# EAGLE design OSO-MISC-20-018 Memory Gadget (EAGLE 9.6.2)
CHECKED: KTOWN; COMPANY: ADAFRUIT INDUSTRIES; DRAWN: KTOWN; REV: A
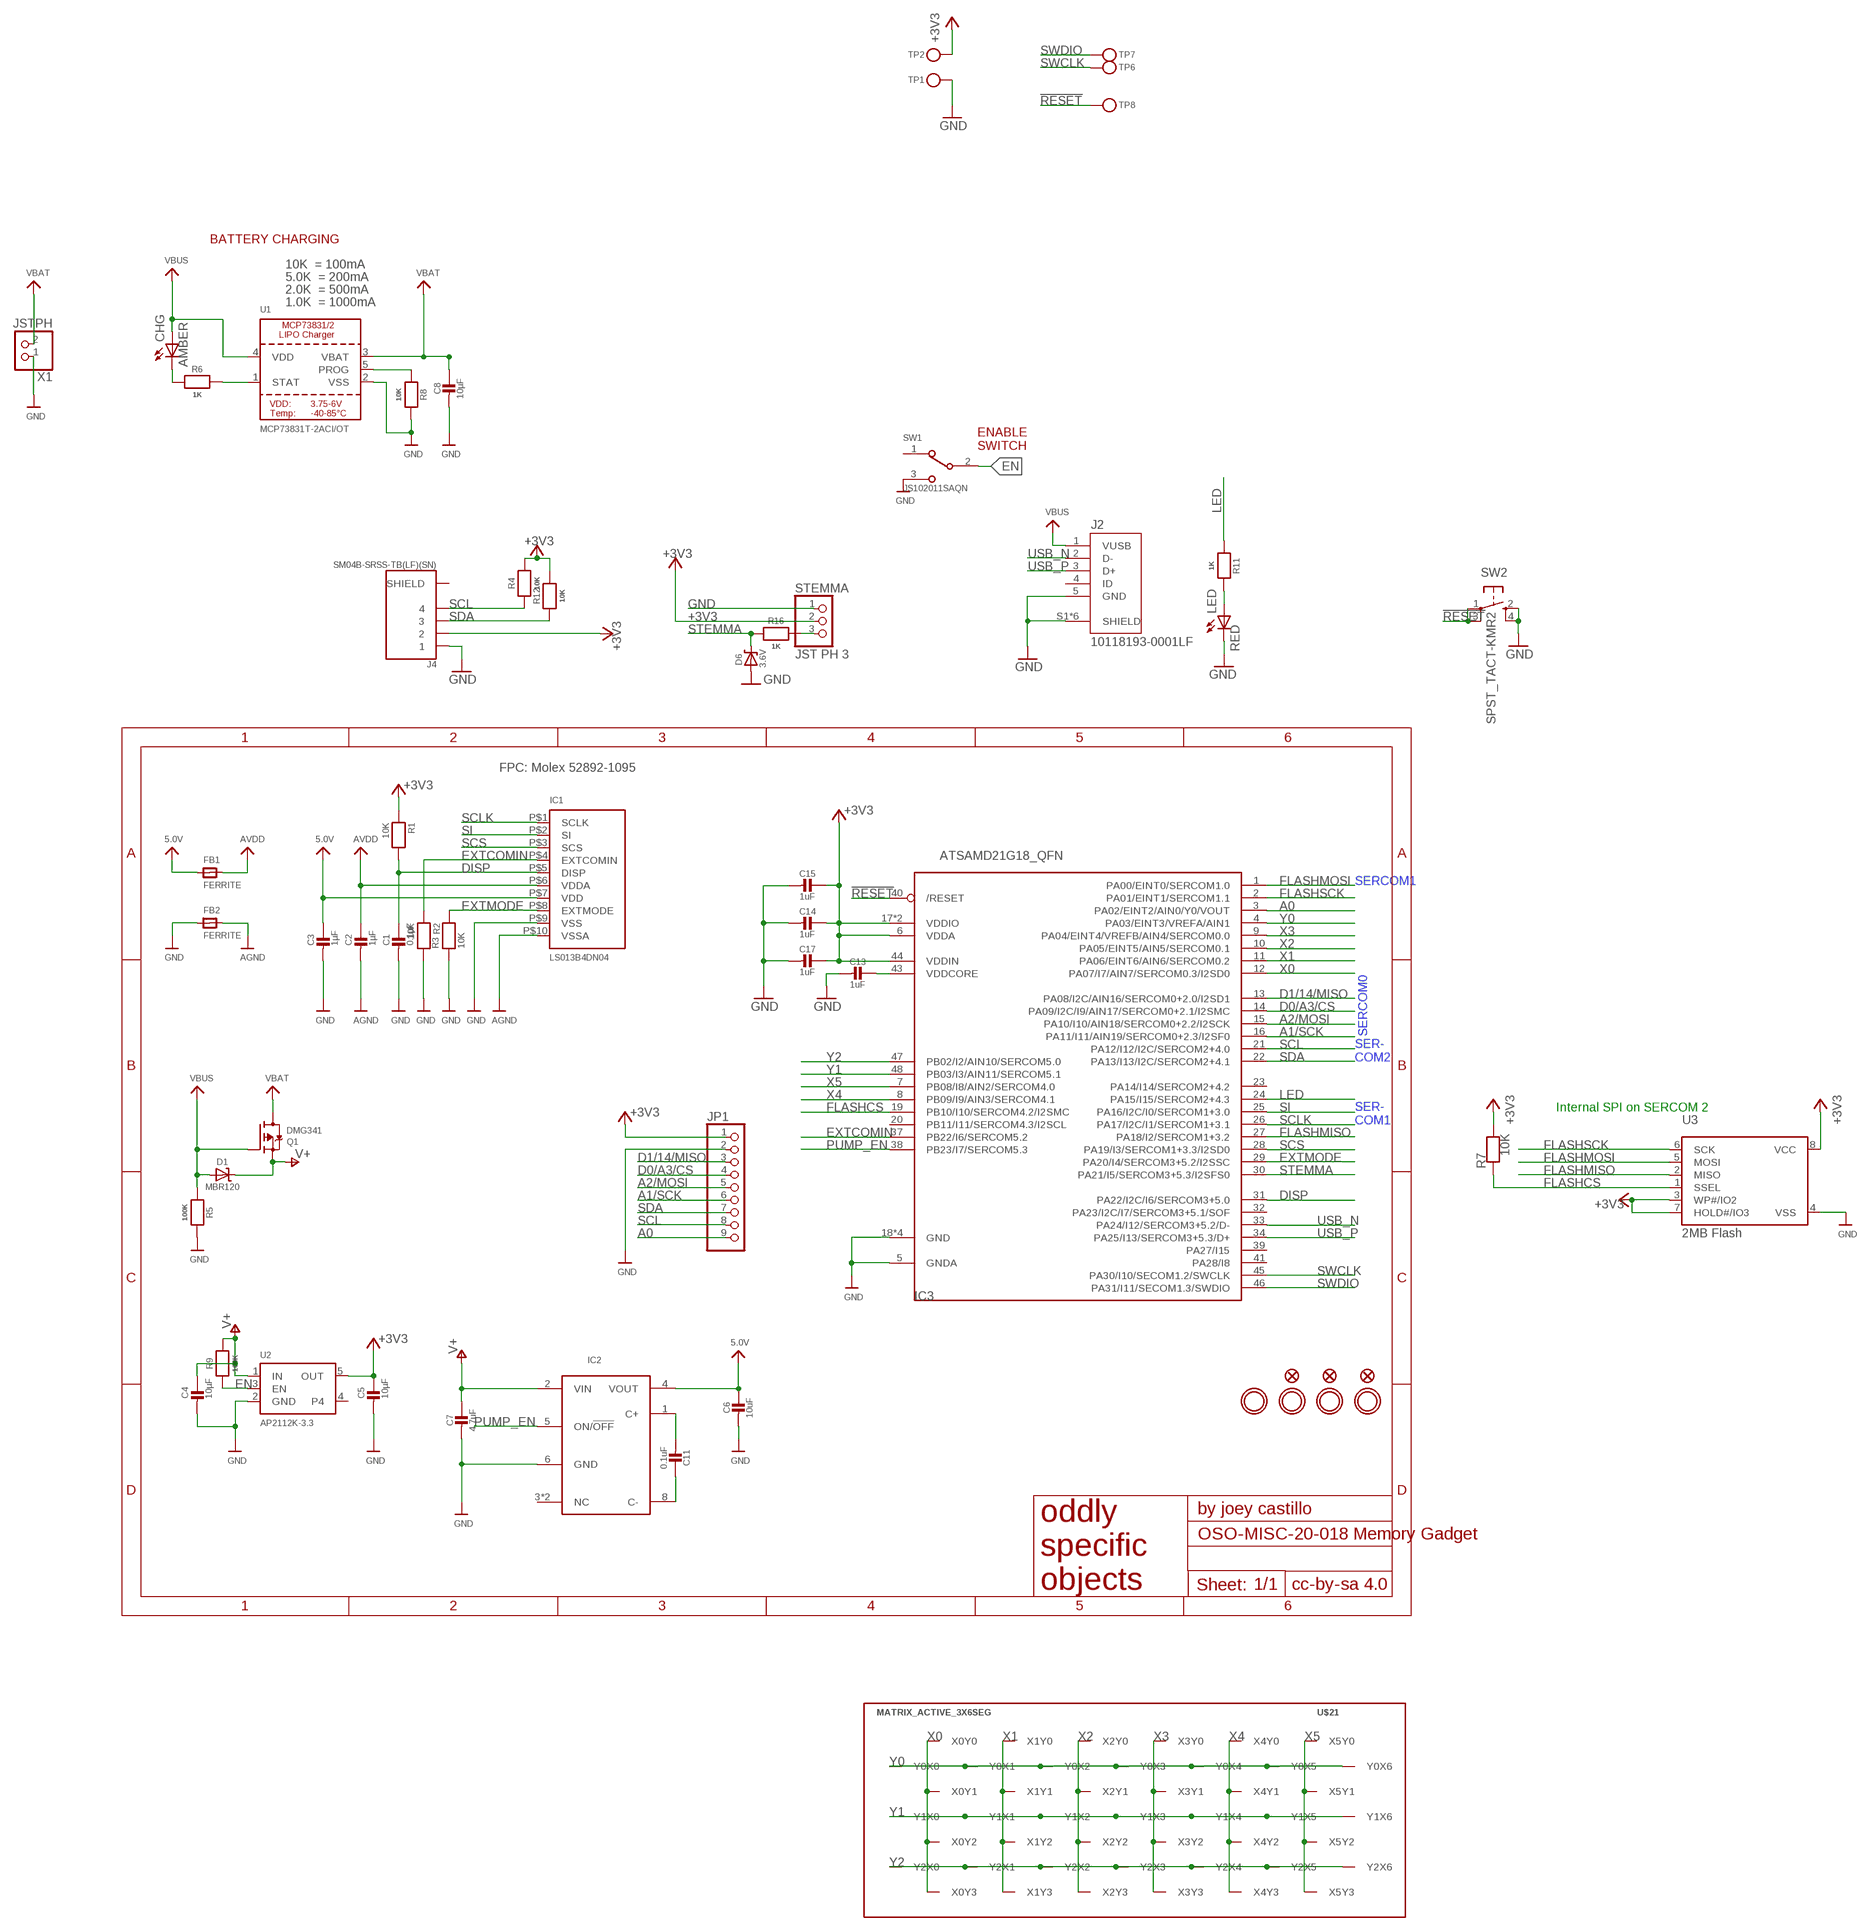
[diagram p0: schematic, sheet 1]

## Parts
C1  0.1µF  CAP_CERAMIC0603_NO  [0603-NO]
C2  1µF  CAP_CERAMIC0805_10MGAP  [0805_10MGAP]
C3  1µF  CAP_CERAMIC0805-NOOUTLINE  [0805-NO]
C4  10µF  CAP_CERAMIC0805-NOOUTLINE  [0805-NO]
C5  10µF  CAP_CERAMIC0805-NOOUTLINE  [0805-NO]
C6  10uF  CAP_CERAMIC0805-NOOUTLINE  [0805-NO]
C7  4.7uF  CAP_CERAMIC0805-NOOUTLINE  [0805-NO]
C8  10µF  CAP_CERAMIC0805-NOOUTLINE  [0805-NO]
C11  0.1uF  CAP_CERAMIC0805-NOOUTLINE  [0805-NO]
C13  1uF  CAP_CERAMIC0603_NO  [0603-NO]
C14  1uF  CAP_CERAMIC0603_NO  [0603-NO]
C15  1uF  CAP_CERAMIC0603_NO  [0603-NO]
C17  1uF  CAP_CERAMIC0603_NO  [0603-NO]
CHG  AMBER  LEDCHIP-LED0805  [CHIP-LED0805]
D1  MBR120  DIODE-SCHOTTKYSOD-123  [SOD-123]
D6  3.6V  DIODE-ZENERSOD123  [SOD-123]
FB1  FERRITE  FERRITE_0805  [_0805]
FB2  FERRITE  FERRITE_0805  [_0805]
FID1  FIDUCIAL_1MM  [FIDUCIAL_1MM]
FID2  FIDUCIAL_1MM  [FIDUCIAL_1MM]
FID3  FIDUCIAL_1MM  [FIDUCIAL_1MM]
IC1  LS013B4DN04  DISP_EINK_SHARPMEMORYLCD_10PIN_27IN  [SHARP_2.7IN]
IC2  S-882150APH  [SNT-8A]
IC3  ATSAMD21G18_QFN  ATSAMD21G_QFN  [TQFN48_7MM]
J2  10118193-0001LF  [FCI_10118193-0001LF]
J4  SM04B-SRSS-TB(LF)(SN)  [JST_SM04B-SRSS-TB(LF)(SN)]
JP1  HEADER-1X9_JSTSH  [JST_SH9]
LED  RED  LEDCHIP-LED0805  [CHIP-LED0805]
Q1  DMG341  MOSFET-P  [SOT23-R]
R1  10K  RESISTOR_0603_NOOUT  [0603-NO]
R2  10K  RESISTOR_0603_NOOUT  [0603-NO]
R3  10K  RESISTOR_0603_NOOUT  [0603-NO]
R4  10K  RESISTOR_0603_NOOUT  [0603-NO]
R5  100K  RESISTOR0805_NOOUTLINE  [0805-NO]
R6  1K  RESISTOR0805_NOOUTLINE  [0805-NO]
R7  10K  RESISTOR_0603_NOOUT  [0603-NO]
R8  10K  RESISTOR0805_NOOUTLINE  [0805-NO]
R9  100K  RESISTOR0805_NOOUTLINE  [0805-NO]
R11  1K  RESISTOR0805_NOOUTLINE  [0805-NO]
R12  10K  RESISTOR_0603_NOOUT  [0603-NO]
R16  1K  RESISTOR_0805MP  [_0805MP]
STEMMA  JST PH 3  CON_JST_PH_3PIN  [JSTPH3]
SW1  JS102011SAQN  [SW_JS102011SAQN]
SW2  SPST_TACT-KMR2  [KMR2]
TP1  TESTPOINTROUND2MMNO  [TESTPOINT_ROUND_2MM_NO]
TP2  TESTPOINTROUND2MMNO  [TESTPOINT_ROUND_2MM_NO]
TP6  TESTPOINTROUND2MMNO  [TESTPOINT_ROUND_2MM_NO]
TP7  TESTPOINTROUND2MMNO  [TESTPOINT_ROUND_2MM_NO]
TP8  TESTPOINTROUND2MMNO  [TESTPOINT_ROUND_2MM_NO]
U1  MCP73831T-2ACI/OT  MCP73831/2  [SOT23-5]
U2  AP2112K-3.3  VREG_SOT23-5  [SOT23-5]
U3  2MB Flash  SPIFLASH_SOIC8  [SOIC8_150MIL]
U$9  MOUNTINGHOLE2.5  [MOUNTINGHOLE_2.5_PLATED]
U$10  MOUNTINGHOLE2.5  [MOUNTINGHOLE_2.5_PLATED]
U$21  MATRIX_ACTIVE_3X6SEG  [MATRIX_ACTIVE_3X6SEG_6MM]
U$27  MOUNTINGHOLE2.5  [MOUNTINGHOLE_2.5_PLATED]
U$28  MOUNTINGHOLE2.5  [MOUNTINGHOLE_2.5_PLATED]
X1  JSTPH  CON_JST_PH_2PIN  [JSTPH2]

## Nets
5.0V: C3.1 C6.1 FB1.1 IC1.P$7(VDD) IC2.4(VOUT)
!RESET: IC3.40(/RESET) SW2.1(P) SW2.3(P1) TP8.P$1
+3V3: C5.1 C14.1 C15.1 C17.1 IC3.6(VDDA) IC3.17(VDDIO) IC3.36(VDDIO) IC3.44(VDDIN) J4.2 JP1.1 R1.1 R4.2 R7.2 R12.2 STEMMA.2 TP2.P$1 U2.5(OUT) U3.3(WP#/IO2) U3.7(HOLD#/IO3) U3.8(VCC)
A0: IC3.3(PA02/EINT2/AIN0/Y0/VOUT) JP1.9
A1/SCK: IC3.16(PA11/I11/AIN19/SERCOM0+2.3/I2SF0) JP1.6
A2/MOSI: IC3.15(PA10/I10/AIN18/SERCOM0+2.2/I2SCK) JP1.5
AGND: C2.2 FB2.2 IC1.P$10(VSSA)
AVDD: C2.1 FB1.2 IC1.P$6(VDDA)
D0/A3/CS: IC3.14(PA09/I2C/I9/AIN17/SERCOM0+2.1/I2SMC) JP1.4
D1/14/MISO: IC3.13(PA08/I2C/AIN16/SERCOM0+2.0/I2SD1) JP1.3
DISP: C1.1 IC1.P$5(DISP) IC3.31(PA22/I2C/I6/SERCOM3+5.0) R1.2
EN: R9.1 SW1.2 U2.3(EN)
EXTCOMIN: IC1.P$4(EXTCOMIN) IC3.37(PB22/I6/SERCOM5.2) R2.1
EXTMODE: IC1.P$8(EXTMODE) IC3.29(PA20/I4/SERCOM3+5.2/I2SSC) R3.2
FLASHCS: IC3.19(PB10/I10/SERCOM4.2/I2SMC) R7.1 U3.1(SSEL)
FLASHMISO: IC3.27(PA18/I2/SERCOM1+3.2) U3.2(MISO)
FLASHMOSI: IC3.1(PA00/EINT0/SERCOM1.0) U3.5(MOSI)
FLASHSCK: IC3.2(PA01/EINT1/SERCOM1.1) U3.6(SCK)
GND: C1.2 C3.2 C4.2 C5.2 C6.2 C7.2 C8.2 C13.2 C14.2 C15.2 C17.2 D6.A FB2.1 IC1.P$9(VSS) IC2.6(GND) IC3.5(GNDA) IC3.18(GND) IC3.35(GND) IC3.42(GND) IC3.THERMAL(GND) J2.5(GND) J2.S1(SHIELD) J2.S2(SHIELD) J2.S3(SHIELD) J2.S4(SHIELD) J2.S5(SHIELD) J2.S6(SHIELD) J4.1 JP1.2 LED.C R2.2 R3.1 R5.2 R8.2 STEMMA.1 SW1.3 SW2.2(S) SW2.4(S1) TP1.P$1 U1.2(VSS) U2.2(GND) U3.4(VSS) X1.1
LED: IC3.24(PA15/I15/SERCOM2+4.3) R11.1
N$1: LED.A R11.2
N$2: CHG.C R6.1
N$3: C11.2 IC2.1(C+)
N$4: C11.1 IC2.8(C-)
PROG: R8.1 U1.5(PROG)
PUMP_EN: IC2.5(ON/!OFF) IC3.38(PB23/I7/SERCOM5.3)
SCL: IC3.21(PA12/I12/I2C/SERCOM2+4.0) J4.4 JP1.8 R4.1
SCLK: IC1.P$1(SCLK) IC3.26(PA17/I2C/I1/SERCOM1+3.1)
SCS: IC1.P$3(SCS) IC3.28(PA19/I3/SERCOM1+3.3/I2SD0)
SDA: IC3.22(PA13/I13/I2C/SERCOM2+4.1) J4.3 JP1.7 R12.1
SI: IC1.P$2(SI) IC3.25(PA16/I2C/I0/SERCOM1+3.0)
STAT: R6.2 U1.1(STAT)
STEMMA: D6.C IC3.30(PA21/I5/SERCOM3+5.3/I2SFS0) R16.2
STEMMA_: R16.1 STEMMA.3
SWCLK: IC3.45(PA30/I10/SECOM1.2/SWCLK) TP6.P$1
SWDIO: IC3.46(PA31/I11/SECOM1.3/SWDIO) TP7.P$1
USB_N: IC3.33(PA24/I12/SERCOM3+5.2/D-) J2.2(D-)
USB_P: IC3.34(PA25/I13/SERCOM3+5.3/D+) J2.3(D+)
V+ [power]: C4.1 C7.1 D1.C IC2.2(VIN) Q1.2(S) R9.2 U2.1(IN)
VBAT [power]: C8.1 Q1.3(D) U1.3(VBAT) X1.2
VBUS [power]: CHG.A D1.A J2.1(VUSB) Q1.1(G) R5.1 U1.4(VDD)
VDDCORE: C13.1 IC3.43(VDDCORE)
X0: IC3.12(PA07/I7/AIN7/SERCOM0.3/I2SD0) U$21.X0Y0 U$21.X0Y1 U$21.X0Y2 U$21.X0Y3
X1: IC3.11(PA06/EINT6/AIN6/SERCOM0.2) U$21.X1Y0 U$21.X1Y1 U$21.X1Y2 U$21.X1Y3
X2: IC3.10(PA05/EINT5/AIN5/SERCOM0.1) U$21.X2Y0 U$21.X2Y1 U$21.X2Y2 U$21.X2Y3
X3: IC3.9(PA04/EINT4/VREFB/AIN4/SERCOM0.0) U$21.X3Y0 U$21.X3Y1 U$21.X3Y2 U$21.X3Y3
X4: IC3.8(PB09/I9/AIN3/SERCOM4.1) U$21.X4Y0 U$21.X4Y1 U$21.X4Y2 U$21.X4Y3
X5: IC3.7(PB08/I8/AIN2/SERCOM4.0) U$21.X5Y0 U$21.X5Y1 U$21.X5Y2 U$21.X5Y3
Y0: IC3.4(PA03/EINT3/VREFA/AIN1) U$21.Y0X0 U$21.Y0X1 U$21.Y0X2 U$21.Y0X3 U$21.Y0X4 U$21.Y0X5 U$21.Y0X6
Y1: IC3.48(PB03/I3/AIN11/SERCOM5.1) U$21.Y1X0 U$21.Y1X1 U$21.Y1X2 U$21.Y1X3 U$21.Y1X4 U$21.Y1X5 U$21.Y1X6
Y2: IC3.47(PB02/I2/AIN10/SERCOM5.0) U$21.Y2X0 U$21.Y2X1 U$21.Y2X2 U$21.Y2X3 U$21.Y2X4 U$21.Y2X5 U$21.Y2X6
Unconnected: IC2.3(NC) IC2.7(NC) IC3.20(PB11/I11/SERCOM4.3/I2SCL) IC3.23(PA14/I14/SERCOM2+4.2) IC3.32(PA23/I2C/I7/SERCOM3+5.1/SOF) IC3.39(PA27/I15) IC3.41(PA28/I8) J2.4(ID) J4.S1(SHIELD) J4.S2(SHIELD) SW1.1 U2.4

## Notes on the sheet
- BATTERY CHARGING
- 10K  = 100mA
- 5.0K  = 200mA
- 2.0K  = 500mA
- 1.0K  = 1000mA
- ENABLE
  SWITCH
- FPC: Molex 52892-1095
- SERCOM1
- SERCOM0
- SER-
  COM2
- Internal SPI on SERCOM 2
- SER-
  COM1

## Library data of the parts
C1-C3 C6-C8 C11 C13-C15 C17 = microbuilder:CAP_CERAMIC: Ceramic Capacitors For new designs, use the packages preceded by an '_' character since they are more reliable: The following footprints should be used on most boards: _0402 - Standard footprint for regular board layouts _0603 - Standard footprint for regular board layouts _0805 - Standard footprint for regular board layouts _1206 - Standard footprint for regular board layouts For extremely tight-pitch boards where space is at a premium, the following 'micro-pitch' footprints can be used (smaller pads, no silkscreen outline, etc.): _0402MP - Micro-pitch footprint for very dense/compact boards _0603MP - Micro-pitch footprint for very dense/compact boards _0805MP - Micro-pitch footprint for very dense/compact boards _1206MP - Micro-pitch footprint for very dense/compact boards
C4 C5 = microbuilder:CAP_CERAMIC: Ceramic Capacitors For new designs, use the packages preceded by an '_' character since they are more reliable: The following footprints should be used on most boards: _0402 - Standard footprint for regular board layouts _0603 - Standard footprint for regular board layouts _0805 - Standard footprint for regular board layouts _1206 - Standard footprint for regular board layouts For extremely tight-pitch boards where space is at a premium, the following 'micro-pitch' footprints can be used (smaller pads, no silkscreen outline, etc.): _0402MP - Micro-pitch footprint for very dense/compact boards _0603MP - Micro-pitch footprint for very dense/compact boards _0805MP - Micro-pitch footprint for very dense/compact boards _1206MP - Micro-pitch footprint for very dense/compact boards; REV: A
CHG LED = adafruit:LED: LED OSRAM: - CHIPLED LG R971, LG N971, LY N971, LG Q971, LY Q971, LO R971, LY R971 LH N974, LH R974 LS Q976, LO Q976, LY Q976 LO Q996 - Hyper CHIPLED LW Q18S LB Q993, LB Q99A, LB R99A - SideLED LS A670, LO A670, LY A670, LG A670, LP A670 LB A673, LV A673, LT A673, LW A673 LH A674 LY A675 LS A676, LA A676, LO A676, LY A676, LW A676 LS A679, LY A679, LG A679 - Hyper Micro SIDELED® LS Y876, LA Y876, LO Y876, LY Y876 LT Y87S - SmartLED LW L88C, LW L88S LB L89C, LB L89S, LG L890 LS L89K, LO L89K, LY L89K LS L896, LA L896, LO L896, LY L896 - TOPLED LS T670, LO T670, LY T670, LG T670, LP T670 LSG T670, LSP T670, LSY T670, LOP T670, LYG T670 LG T671, LOG T671, LSG T671 LB T673, LV T673, LT T673, LW T673 LH T674 LS T676, LA T676, LO T676, LY T676, LB T676, LH T676, LSB T676, LW T676 LB T67C, LV T67C, LT T67C, LS T67K, LO T67K, LY T67K, LW E67C LS E67B, LA E67B, LO E67B, LY E67B, LB E67C, LV E67C, LT E67C LW T67C LS T679, LY T679, LG T679 LS T770, LO T770, LY T770, LG T770, LP T770 LB T773, LV T773, LT T773, LW T773 LH T774 LS E675, LA E675, LY E675, LS T675 LS T776, LA T776, LO T776, LY T776, LB T776 LHGB T686 LT T68C, LB T68C - Hyper Mini TOPLED® LB M676 - Mini TOPLED Santana® LG M470 LS M47K, LO M47K, LY M47K Source: http://www.osram.convergy.de/
D1 = microbuilder:DIODE-SCHOTTKY
D6 = microbuilder:DIODE-ZENER: Zener Diode SMA: 30V 1W Zener Diode, 1.2Vf - Digikey: SMAZ30-FDICT-ND
FB1 FB2 = microbuilder:FERRITE: Ferrite Bead 0603 MMZ1608B121C - 120 Ohm @ 100MHz, 600mA, 0.15 Ohm DC Resistance - Digikey: 445-2164-1-ND BK1608HW121-T - 120 Ohm, 600mA Ferrite Chip - Digikey: 587-1876-2-ND 0805 HZ0805B272R-10 - 2.7K Ohm @ 100MHz, 200mA, 0.8 Ohm DC Resistance - Digikey: 240-2504-1-ND (see also Murata BLM21BD272SN1L) MMZ2012Y152B - 1.5K Ohm @ 100MHz, 500mA, 0.4 Ohm DC Resistance - Digikey: 445-1560-1-ND - Mainly for high frequency (80-400MHz) MMZ2012R102A - 1K Ohm @ 100MHz, 500mA, 0.3 Ohm DC Resistance - Digikey: 445-1555-2-ND - More general purpose (10-200MHz)
FID1 FID2 = microbuilder:FIDUCIAL: Fiducial Alignment Points Various fiducial points for machine vision alignment.; BOM: EXCLUDE
FID3 = microbuilder:FIDUCIAL: Fiducial Alignment Points Various fiducial points for machine vision alignment.; BOM: EXCLUDE; REV: A
IC1 = adafruit_display:DISP_EINK_SHARPMEMORYLCD_10PIN: Sharp Mono Memory LCD LS013B4DN04 - 1.35" 96x96 Pixels LS027B7DH01 - 2.7" 400x240 Pixels FPC Connector: Molex 52892-1095 (WM9203CT-ND)
IC2 = My Stuff:S-882150APH
IC3 = microbuilder:ATSAMD21G
J2 = 10118193-0001LF:10118193-0001LF: Micro USB B Type Receptacle; DESCRIPTION: Single Port 5 Contact Shielded SMT MICRO USB B-Type Receptacle; DIGI-KEY_PART_NUMBER: 609-4616-1-ND; DIGI-KEY_PURCHASE_URL: https://www.digikey.com/product-detail/en/amphenol-icc-fci/10118193-0001LF/609-4616-1-ND/2785380?utm_source=snapeda&utm_medium=aggregator&utm_campaign=symbol; MF: Amphenol ICC; MP: 10118193-0001LF; PACKAGE: None
J4 = SM04B-SRSS-TB_LF__SN_:SM04B-SRSS-TB(LF)(SN): SH Series 1.0 mm Pitch 2 Position Single Row Side Entry Shrouded Header; DESCRIPTION: SH Series 1.0 mm Pitch 2 Position Single Row Side Entry Shrouded Header; DIGI-KEY_PART_NUMBER: 455-1804-1-ND; DIGI-KEY_PURCHASE_URL: https://www.digikey.com/product-detail/en/jst-sales-america-inc/SM04B-SRSS-TB_LF__SN_/455-1804-1-ND/926875?utm_source=snapeda&utm_medium=aggregator&utm_campaign=symbol; MF: JST Sales; MP: SM04B-SRSS-TB_LF__SN_; PACKAGE: None
JP1 = microbuilder:HEADER-1X9: PIN HEADER
Q1 = microbuilder:MOSFET-P: P-Channel Mosfet LEGEND VDS: Voltage Drain-Source ID: Drain Current RDS(ON): Drain-Source On-State Resistance VGS(TH): Gate-Source Threshold Voltage CISS: Drain-Source Input Capacitance SOT-23 Name VDS ID RDS(ON) VGS(TH) CISS Order Number IRLML5103 30V 760mA 600 mOhm -- 75pF @ 25V Digikey: IRLML5103PBFCT-ND IRLML6401 12V 4.3A 50 mOhm 950mV @ 250µA 830pF @ 10V Digikey: IRLML6401PBFTR-ND NTR0202PL 20V 400mA 800 mOhm 2.3V @ 250uA 70pF @ 5V Digikey: NTR0202PLT1GOSTR-ND NTR4101PT1G 20V 1.8A 85 mOhm 1.2V @ 250uA 675pF @ 10V Digikey: NTR4101PT1GOSCT-ND DMP2004K 20V 600mA 900 mOhm 1V @ 250uA 175pF @ 16V Digikey: DMP2004KDICT-ND PMV65XP 20V 3.9A 76 mOhm 950mV @ 1mA 725pF @ 20V Digikey: 568-2358-2-ND TO-252 Name VDS ID RDS(ON) VGS(TH) CISS Order Number AOD417 30V 25A 34 mOhm 3V @ 250µA 920pF @ 15V Digikey: 785-1106-2-ND PowerPak Name VDS ID RDS(ON) VGS(TH) CISS Order Number AON7401 30V 12A 14 mOhm 3V @ 250µA 2600pF @ 15V Digikey: 785-1302-1-ND
R1 R2 R4-R9 R11 R12 R16 = microbuilder:RESISTOR: Resistors For new designs, use the packages preceded by an '_' character since they are more reliable: The following footprints should be used on most boards: _0402 - Standard footprint for regular board layouts _0603 - Standard footprint for regular board layouts _0805 - Standard footprint for regular board layouts _1206 - Standard footprint for regular board layouts For extremely tight-pitch boards where space is at a premium, the following 'micro-pitch' footprints can be used (smaller pads, no silkscreen outline, etc.): _0402MP - Micro-pitch footprint for very dense/compact boards _0603MP - Micro-pitch footprint for very dense/compact boards _0805MP - Micro-pitch footprint for very dense/compact boards _1206MP - Micro-pitch footprint for very dense/compact boards
R3 = microbuilder:RESISTOR: Resistors For new designs, use the packages preceded by an '_' character since they are more reliable: The following footprints should be used on most boards: _0402 - Standard footprint for regular board layouts _0603 - Standard footprint for regular board layouts _0805 - Standard footprint for regular board layouts _1206 - Standard footprint for regular board layouts For extremely tight-pitch boards where space is at a premium, the following 'micro-pitch' footprints can be used (smaller pads, no silkscreen outline, etc.): _0402MP - Micro-pitch footprint for very dense/compact boards _0603MP - Micro-pitch footprint for very dense/compact boards _0805MP - Micro-pitch footprint for very dense/compact boards _1206MP - Micro-pitch footprint for very dense/compact boards; REV: A
STEMMA = microbuilder:CON_JST_PH_3PIN
SW1 = JS102011SAQN:JS102011SAQN: JS10 Series SPDT On-On 6 V 0.3 A Gull Wing SMT Slide Switch http://www.snapeda.com/parts/JS102011SAQN/C%26K%20Components/view-part/; DESCRIPTION: Slide Switch SPDT Surface Mount, Right Angle; DIGI-KEY_PART_NUMBER: 401-1999-1-ND; DIGI-KEY_PURCHASE_URL: https://www.digikey.com/product-detail/en/c-k/JS102011SAQN/401-1999-1-ND/1640114?utm_source=snapeda&utm_medium=aggregator&utm_campaign=symbol; MF: C&K; MP: JS102011SAQN; PACKAGE: None
SW2 = adafruit:SPST_TACT: SMT 6mm switch, EVQQ2 series http://www.ladyada.net/library/eagle
TP1 TP2 TP6-TP8 = microbuilder:TESTPOINT: Test Point Various test points for characterisation and PCB testing TESTPOINT_SMT - Compact Surface Mount Test Point [Digikey: 5016KTR-ND]
U1 = microbuilder:MCP73831/2: MCP73831/2 LIPO Charger VDD: 3.75 - 6V Temp -40 - 85°C Programmable Charge Rate: 15-500mA NOTE: STAT is a tri-state logic output on the MCP73831 and an open-drain output on the MCP73832. SOT23-5 with 4.2V output and tri-state logic on STAT = MCP73831T-2ACI/OT
U2 = adafruit_power:VREG_SOT23-5: SOT23-5 Fixed Voltage Regulators Part Current Out V Out V In V Dropout θJA (°C/W) TJ (°C) Digikey Part No. ADP121 150mA 3.3V 3.4-5.5V 0.09V @ 150mA -- -- ADP121-AUJZ33R7CT-ND ADP121 150mA 3.0V 3.1-5.5V 0.09V @ 150mA -- -- ADP121-AUJZ30R7CT-ND ADP122 300mA 3.3V 3.4-5.5V 0.085V @ 300mA -- -- ADP122AUJZ-3.3-R7CT-ND ADP1712 300mA 3.3V 3.5-5.5V 0.17V @ 300mA -- -- ADP1712AUJZ-3.3-R7TR-ND AP7311 (Low Cost) 150mA 3.3V 3.5-6V 0.15V @ 150mA -- -- AP7311-33WG-7DICT-ND LD39015M18R 150mA 1.8V 1.9V-5.5V 0.08V @ 100mA -- -- 497-6977-1-ND LP2985A-33DBVR 150mA 3.3V 3.3-16V 0.28V @ 150mA 206 150 296-18479-1-ND MCP1824T-3302E/OT 300mA 3.3V 3.5V-6V 0.2V @ 300mA -- -- MCP1824T-3302E/OTCT-ND MIC5205-2.5YM5 TR 150mA 2.5V 2.7-16V 0.165V @ 150mA -- -- 576-1257-2-ND MIC5205-3.0YM5 TR 150mA 3.0V 3.2V-16V 0.165V @ 150mA -- -- 576-1258-2-ND MIC5205-3.3YM5 TR 150mA 3.3V 3.5V-16V 0.165V @ 150mA -- -- 576-1259-2-ND TPS780330220 150mA 3.3V+2.2V 3.6-5.5V 250mV Max -- -- 296-23332-1-ND TDA3663/N1,135 100mA 3.3V 3.5-45V 0.18V @ 50mA -- -- 568-5343-1-ND Max operating temp can be calculated using θJA, TJ (max junction temperature), and power in watts. Set the "Maximum Ambient Temperature" until it reaches TJ ("Max Junction Temperature"), which is the absolute limit for safe use of the regulator: Heat Sink Temperature Calculator <http://www.daycounter.com/Calculators/Heat-Sink-Temperature-Calculator.phtml> For example, With 12V source into a 3.3V LP2985 and a 30mA load, we are dissipating (12V-3.3V) * 0.03A = 0.261W. With a θJA of 206 °C/W, a TJ of 150°C, and 261mW we can safely use the chip without a heat sink up to 75°C (=147.1°C Junction Temperature).
U3 = microbuilder:SPIFLASH_SOIC8: SOIC8 SPI Flash Be careful with the size since SOIC8 flash comes in several 'widths' SOIC8 150 mil M25P16 - 16Mbit (2Mbit x 8) Serial Flash (75MHz SPI Bus), Supply: 2.7-3.6V Digikey: SOIC8 - M25P16-VMN6P-ND SOIC8 208 mil W25Q16BVSSIG - 16Mbit (2Mbit x 8) Serial Flash (104MHz SPI Bus), Supply: 2.7-3.6V Digikey: SOIC8 - W25Q16BVSSIG-ND
U$9 U$10 U$27 U$28 = microbuilder:MOUNTINGHOLE: Mounting Hole For #2 screws (0.086"/2.18mm width, 0.094"/2.4mm hole) use 2.5mm; BOM: EXCLUDE; REV: A
U$21 = My Stuff:MATRIX_ACTIVE_3X6SEG
X1 = microbuilder:CON_JST_PH_2PIN: JST 2-Pin Right-Angle Connector PH-Series - 4UConnector: 17311 SH-Series - 4UConnector: 07278

## Net classes
1 power: width 0.305 mm, drill 0.305 mm
2 gnd: width 0.254 mm, drill 0.254 mm

## Board
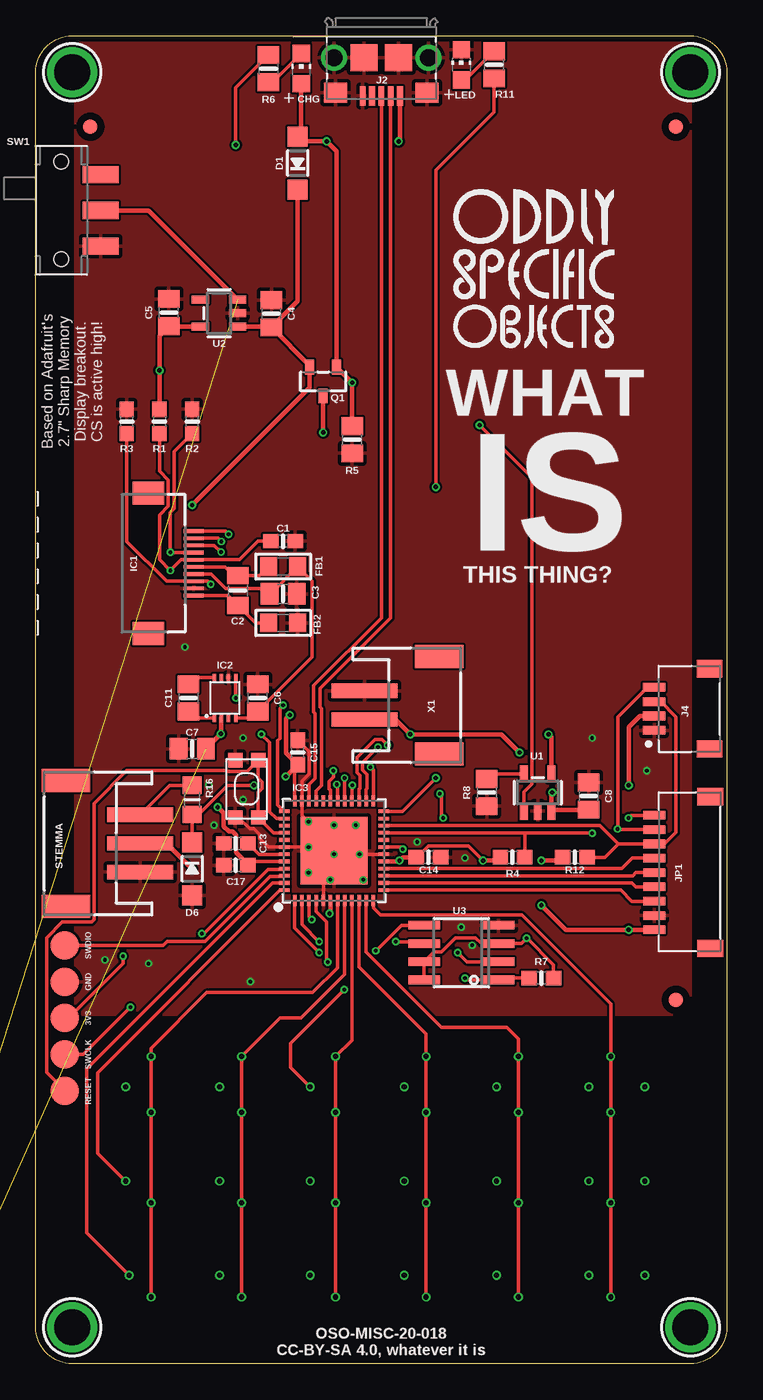
[diagram p1: board, top side]
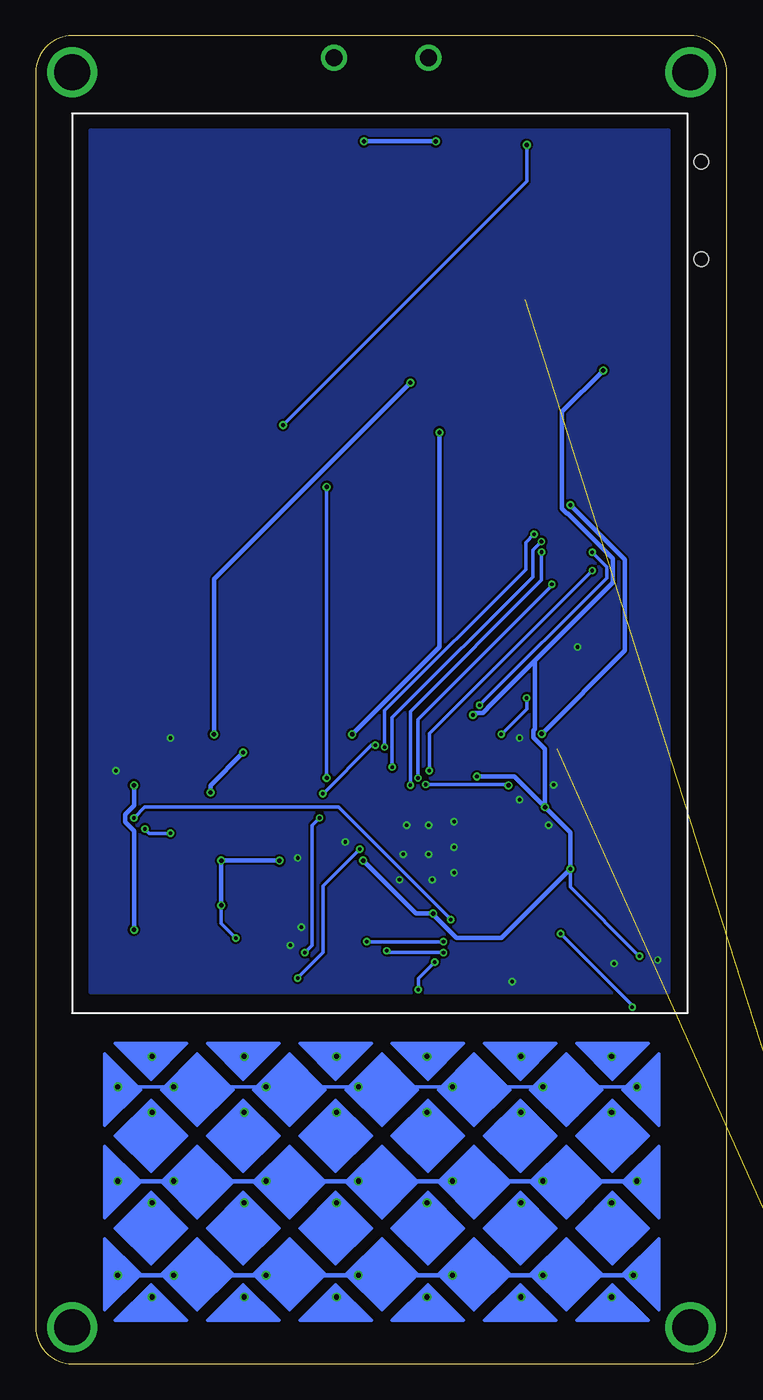
[diagram p2: board, bottom side, seen from below]

Size 48.26 x 92.71 mm. Coordinates in mm from the lower left corner, seen from the top.
Outline: 48.26,90.17 48.26,2.54 arc-90 45.72,0 2.54,0 arc-90 0,2.54 0,90.17 arc-90 2.54,92.71 45.72,92.71 arc-90 48.26,90.17
Copper layers (1*16): Top 0.035559375mm / dielectric 1.6mm / Bottom 0.035559375mm
Design rules "oshpark-2layer *": minimum track width 6mil, minimum drill 10mil, track to track 6mil, track to pad 6mil, pad to pad 6mil, via to via 6mil, smd to smd 6mil, copper to edge 15mil, drill to drill 6mil, minimum pad ring 5mil, minimum via ring 5mil, stop-mask expansion 2.5mil, vias tented up to drill 12mil, thermal gap 10mil
tKeepout: area 22.6,51.3 to 48,84.3

### Footprints (pad centres in the part's own frame; a part is rotated, then mirrored left to right if it is on the bottom)
0603-NO = smd 1.075 x 1: 1 -0.85,0; 2 0.85,0
0805_10MGAP = smd 1.2 x 1.5: 1 -1.05,0; 2 1.05,0
0805-NO = smd 1.24 x 1.5: 1 -0.95,0; 2 0.95,0
CHIP-LED0805 = smd 1.2 x 1.2: A 0,-1.05; C 0,1.05
SOD-123 = smd 1.4 x 1.4: A 1.85,0; C -1.85,0
_0805 = smd 1.2 x 1.3: 1 -1.016,0; 2 1.016,0
FIDUCIAL_1MM = smd 1 x 1: 1 0,0
SHARP_2.7IN = smd 0.25 x 1.4: P$1 -2.25,2.9; P$2 -1.75,2.9; P$3 -1.25,2.9; P$4 -0.75,2.9; P$5 -0.25,2.9; P$6 0.25,2.9; P$7 0.75,2.9; P$8 1.25,2.9; P$9 1.75,2.9; P$10 2.25,2.9 | smd 1.6 x 2.2: SUPPORT1 -4.9,-0.25; SUPPORT2 4.9,-0.25
SNT-8A = smd 0.25 x 0.52: 1 -0.75,-1.415; 2 -0.25,-1.415; 3 0.25,-1.415; 4 0.75,-1.415; 5 0.75,1.415; 6 0.25,1.415; 7 -0.25,1.415; 8 -0.75,1.415
TQFN48_7MM = smd 0.25 x 0.75: 1 -2.75,-3.475; 2 -2.25,-3.475; 3 -1.75,-3.475; 4 -1.25,-3.475; 5 -0.75,-3.475; 6 -0.25,-3.475; 7 0.25,-3.475; 8 0.75,-3.475; 9 1.25,-3.475; 10 1.75,-3.475; 11 2.25,-3.475; 12 2.75,-3.475; 25 2.75,3.475; 26 2.25,3.475; 27 1.75,3.475; 28 1.25,3.475; 29 0.75,3.475; 30 0.25,3.475; 31 -0.25,3.475; 32 -0.75,3.475; 33 -1.25,3.475; 34 -1.75,3.475; 35 -2.25,3.475; 36 -2.75,3.475 | smd 0.75 x 0.25: 13 3.475,-2.75; 14 3.475,-2.25; 15 3.475,-1.75; 16 3.475,-1.25; 17 3.475,-0.75; 18 3.475,-0.25; 19 3.475,0.25; 20 3.475,0.75; 21 3.475,1.25; 22 3.475,1.75; 23 3.475,2.25; 24 3.475,2.75; 37 -3.475,2.75; 38 -3.475,2.25; 39 -3.475,1.75; 40 -3.475,1.25; 41 -3.475,0.75; 42 -3.475,0.25; 43 -3.475,-0.25; 44 -3.475,-0.75; 45 -3.475,-1.25; 46 -3.475,-1.75; 47 -3.475,-2.25; 48 -3.475,-2.75 | smd 4.7 x 4.7: THERMAL 0,0
FCI_10118193-0001LF = smd 0.4 x 1.35: 1 -1.3,2.675; 2 -0.65,2.675; 3 0,2.675; 4 0.65,2.675; 5 1.3,2.675 | smd 1.6 x 1.4: S1 -3.2,2.45; S2 3.2,2.45 | smd 1.9 x 1.9: S3 1.2,0; S4 -1.2,0 | drill 1.2: S5 3.302,0; S6 -3.302,0
JST_SM04B-SRSS-TB(LF)(SN) = smd 0.6 x 1.55: 1 -1.5,0; 2 -0.5,0; 3 0.5,0; 4 1.5,0 | smd 1.2 x 1.8: S1 -2.8,-3.875; S2 2.8,-3.875
JST_SH9 = smd 0.6 x 1.55: 1 -4,2.514; 2 -3,2.514; 3 -2,2.514; 4 -1,2.514; 5 0,2.514; 6 1,2.514; 7 2,2.514; 8 3,2.514; 9 4,2.514 | smd 1.2 x 1.8: MT1 -5.3,-1.386; MT2 5.3,-1.386
SOT23-R = smd 0.635 x 1.016: 1 -0.95,-1; 2 0.95,-1; 3 0,1
_0805MP = smd 1.2 x 1.3: 1 -1.016,0; 2 1.016,0
JSTPH3 = smd 1 x 4.6: 1 -2,-2.7; 2 0,-2.7; 3 2,-2.7 | smd 1.6 x 3.4: NC1 -4.4,2.5; NC2 4.4,2.5
SW_JS102011SAQN = smd 1.2 x 2.5: 1 -2.5,2.75; 2 0,2.75; 3 2.5,2.75 | hole 1: -3.4,0; 3.4,0
KMR2 = smd 1 x 1: 1 2,0.8; 2 2,-0.8; 3 -2,0.8; 4 -2,-0.8
TESTPOINT_ROUND_2MM_NO = smd 2 x 2: P$1 0,0
SOT23-5 = smd 0.55 x 1.2: 1 -0.95,-1.3; 2 0,-1.3; 3 0.95,-1.3; 4 0.95,1.3; 5 -0.95,1.3
SOIC8_150MIL = smd 0.6 x 2.2: 1 -1.905,-2.6; 2 -0.635,-2.6; 3 0.635,-2.6; 4 1.905,-2.6; 5 1.905,2.6; 6 0.635,2.6; 7 -0.635,2.6; 8 -1.905,2.6
MOUNTINGHOLE_2.5_PLATED = drill 2.5 pad 3.2: P$1 0,0
MATRIX_ACTIVE_3X6SEG_6MM = drill 0.356: X0Y0 -16.018,8.747; X0Y1 -16.018,4.842; X0Y2 -16.018,-1.476; X0Y3 -16.018,-8.048; X1Y0 -9.573,8.747; X1Y1 -9.573,4.842; X1Y2 -9.573,-1.476; X1Y3 -9.573,-8.048; X2Y0 -3.128,8.747; X2Y1 -3.128,4.842; X2Y2 -3.128,-1.476; X2Y3 -3.128,-8.048; X3Y0 3.19,8.747; X3Y1 3.19,4.842; X3Y2 3.19,-1.476; X3Y3 3.19,-8.048; X4Y0 9.762,8.747; X4Y1 9.762,4.842; X4Y2 9.762,-1.476; X4Y3 9.762,-8.048; X5Y0 16.08,8.747; X5Y1 16.08,4.842; X5Y2 16.08,-1.476; X5Y3 16.08,-8.048; Y0X0 -18.399,6.62; Y0X1 -14.494,6.62; Y0X2 -8.049,6.62; Y0X3 -1.604,6.62; Y0X4 4.968,6.62; Y0X5 11.286,6.62; Y0X6 17.858,6.62; Y1X0 -18.399,0.048; Y1X1 -14.494,0.048; Y1X2 -8.049,0.048; Y1X3 -1.604,0.048; Y1X4 4.968,0.048; Y1X5 11.286,0.048; Y1X6 17.858,0.048; Y2X0 -18.399,-6.524; Y2X1 -14.494,-6.524; Y2X2 -8.049,-6.524; Y2X3 -1.604,-6.524; Y2X4 4.968,-6.524; Y2X5 11.286,-6.524; Y2X6 17.604,-6.524
JSTPH2 = smd 1 x 4.6: 1 -1,-3.7; 2 1,-3.7 | smd 1.6 x 3.4: NC1 -3.4,1.5; NC2 3.4,1.5

### Placement (x,y rotation side)
C1  17.27,57.43 0 top
C2  14.13,53.97 270 top
C3  17.27,53.75 0 top
C4  16.45,73.31 90 top
C5  9.29,73.39 90 top
C6  15.49,46.48 90 top
C7  10.92,42.93 180 top
C8  38.61,39.62 90 top
C11  10.67,46.48 270 top
C13  13.97,36.32 180 top
C14  27.43,35.36 0 top
C15  18.29,42.67 90 top
C17  13.97,34.8 180 top
CHG  18.54,90.42 0 top
D1  18.29,83.82 90 top
D6  10.92,34.54 270 top
FB1  17.27,55.65 180 top
FB2  17.27,51.72 180 top
FID1  44.7,86.36 90 top
FID2  44.7,25.4 90 top
FID3  3.81,86.36 90 top
IC1  8.13,55.88 270 top
IC2  13.21,46.48 0 top
IC3  20.83,35.81 0 top
J2  24.13,91.19 180 top
J4  43.18,45.72 90 top
JP1  45.72,34.29 90 top
LED  29.72,90.68 0 top
Q1  20.07,68.58 180 top
R1  8.64,65.79 270 top
R2  10.92,65.79 90 top
R3  6.35,65.79 270 top
R4  33.3,35.36 180 top
R5  22.1,64.52 270 top
R6  16.26,90.42 90 top
R7  35.31,26.92 0 top
R8  31.5,39.88 270 top
R9  -8.89,-1.27 0 top  (outside the outline)
R11  32,90.68 90 top
R12  37.64,35.36 180 top
R16  10.92,39.37 270 top
STEMMA  4.6,36.32 90 top
SW1  1.78,80.52 270 top
SW2  14.73,40.13 270 top
TP1  2.03,26.67 90 top
TP2  2.03,24.13 90 top
TP6  2.03,21.59 90 top
TP7  2.03,29.21 90 top
TP8  2.03,19.05 90 top
U1  35.05,39.88 0 top
U2  12.8,73.35 90 top
U3  29.72,28.7 90 top
U$9  2.54,90.17 270 top
U$10  2.54,2.54 270 top
U$16  [OSO_WORDMARK_THREELINE_450MIL_1000DPI]  34.8,76.45 0 top
U$21  24.13,12.7 0 bottom
U$27  45.72,2.54 180 top
U$28  45.72,90.17 0 top
X1  26.67,45.97 270 top

### Tracks (layer width: path | path; a pad name or v marks a point on that pad's centre or on a via)
5.0V
  Top 0.254: IC1.P$7 12.26,55.13 13.27,54.12 15.95,54.12 C3.1 16.38,53.75 FB1.1 19.3,54.64 19.3,49.34 C6.1 15.03,45.07 IC2.4
!RESET
  Top 0.254: IC3.40 16.6,37.06 SW2.1 15.53,39.89 15.8,40.15 15.8,40.62 15.53,40.88 SW2.3 14.75,41.35 13.32,41.35 13.27,41.4 6.35,41.4 4.08,39.13 4.08,31.01 3.91,30.84 1.85,30.84 0.75,29.74 0.75,20.33 TP8.P$1
+3V3  (via drill 0.25, 0.3)
  Top 0.254: IC3.44 15.09,35.06 C17.1 | IC3.36 18.08,41.61 C15.1 | TP2.P$1 2.29,24.13 6.1,27.94 v6.1,28.45 | C14.1 26.65,35.36 27.43,36.14 30.23,36.14 v31.24,35.12 | U3.8 U3.7 27.81,28.76 28.33,28.76 29.32,29.74 30.7,29.74 31.11,29.34 U3.3 33.91,29.34 v34.29,29.72 36.16,27.85 R7.2
  Top 0.305: IC3.6 20.58,31.49 v20.52,31.43 | IC3.17 25.34,35.06 v25.4,35.12 25.63,35.36 C14.1 | v17.45,41 17.46,41 C15.1 17.48,42.63 17.48,45.03 v17.73,45.29 | v12.7,38.86 13.13,38.43 13.13,37.51 13.48,37.15 13.76,37.15 13.98,36.93 13.98,35.7 14.82,34.85 C17.1 | STEMMA.2 9.14,36.32 v10.92,34.54 | U2.5 9.33,72.4 C5.1 8.64,71.78 v8.64,69.34 R1.1 | R4.2 32.22,35.12 v31.24,35.12 | v35.31,35.12 36.56,35.12 R12.2 | JP1.1 v41.4,30.29 37.02,30.29 v35.31,32 | J4.2 42.17,45.22 41.4,44.45 v41.4,40.39
  Bottom 0.254: v6.1,28.45 10.92,33.27 v10.92,34.54 | v34.29,29.72 35.31,30.73 v35.31,32
  Bottom 0.305: v25.4,35.12 21.71,31.43 v20.52,31.43 20.52,31.35 18.89,29.72 15.75,29.72 v10.92,34.54 10.92,37.08 v12.7,38.86 | v17.45,41 14.83,41 v12.7,38.86 | v17.73,45.29 17.61,45.41 17.04,45.41 16.71,45.74 16.71,45.77 13.46,49.02 | v8.64,69.34 11.51,66.47 11.51,59.7 11.16,59.36 11.1,59.36 7.95,56.21 7.95,54.53 13.46,49.02 | v12.7,38.86 12.7,42.93 13.51,43.73 13.51,44.22 13.41,44.31 13.41,48.97 13.46,49.02 | v31.24,35.12 v35.31,35.12 v35.31,32 | v41.4,40.39 41.4,38.99 42.03,38.36 42.03,37.84 41.4,37.21 v41.4,30.29
A0  (via drill 0.25)
  Top 0.254: IC3.3 19.08,31.21 v19.28,31 | v41.4,38.1 41.59,38.29 JP1.9
  Bottom 0.254: v19.28,31 27.13,38.85 40.65,38.85 v41.4,38.1
A1/SCK
  Top 0.254: IC3.16 40.91,34.56 41.66,35.31 43.19,35.31 JP1.6
A2/MOSI
  Top 0.254: IC3.15 41.68,34.06 41.91,34.29 JP1.5
AGND
  Top 0.254: IC1.P$10 13.42,53.63 C2.2 15.33,51.72 FB2.2
AVDD
  Top 0.254: FB1.2 15.63,55.02 C2.1 13.81,55.02 13.2,55.63 IC1.P$6
D0/A3/CS
  Top 0.254: IC3.14 41.62,33.56 41.91,33.27 43.19,33.27 JP1.4
D1/14/MISO
  Top 0.254: IC3.13 40.85,33.06 41.62,32.29 JP1.3
DISP  (via drill 0.25)
  Top 0.254: C1.1 15.52,57.43 14.22,56.13 IC1.P$5 10.16,56.13 v9.4,55.37 8.64,56.13 8.64,59.24 9.26,59.86 9.26,61.7 8.64,62.32 R1.2 | v20.78,41.4 20.78,40.95 20.49,40.66 20.49,40.14 20.58,40.05 IC3.31
  Bottom 0.254: v20.78,41.4 20.78,43.99 v9.4,55.37
EN  (1 unrouted)
  Top 0.305: SW1.2 7.88,80.52 U2.3
EXTCOMIN  (via drill 0.25)
  Top 0.254: v17.27,45.97 17.04,45.74 17.04,43.66 16.9,43.51 16.9,39.02 IC3.37 | IC1.P$4 11.02,56.64 v9.4,56.64 9.4,59.43 9.66,59.7 9.66,63.68 R2.1
  Bottom 0.254: v17.27,45.97 8.38,54.86 8.38,55.63 v9.4,56.64
EXTMODE  (via drill 0.25)
  Top 0.254: v12.21,54.42 12,54.63 IC1.P$8 9.12,54.63 6.35,57.4 R3.2 | IC3.29 21.58,40.15 21.57,40.16 v21.57,40.89
  Bottom 0.254: v21.57,40.89 21.57,44.98 12.21,54.33 v12.21,54.42
FLASHCS  (via drill 0.25)
  Top 0.254: R7.1 32.45,26.92 U3.1 30.1,26.8 v29.97,26.92 | IC3.19 25.49,36.06 v25.64,35.92
  Bottom 0.254: v25.64,35.92 28.19,33.36 28.19,28.7 v29.97,26.92
FLASHMISO  (via drill 0.25)
  Top 0.254: v29.46,28.7 30.1,28.07 U3.2 | IC3.27 22.58,40.11 22.63,40.16 22.63,41.06 22.43,41.27 22.43,42.33 23.68,43.58 24.17,43.58 24.56,43.2 v24.56,43.18 | v28.22,39.79 28.32,39.69 28.32,38.22 v28.45,38.1
  Bottom 0.254: v28.45,38.1 28.96,37.59 28.96,29.21 v29.46,28.7 | v24.56,43.18 24.81,43.18 28.19,39.79 v28.22,39.79
FLASHMOSI  (via drill 0.25)
  Top 0.254: IC3.1 18.08,30.41 v19.79,28.7 | U3.5 25.53,30.61 v23.75,28.82
  Bottom 0.254: v19.79,28.7 23.62,28.7 v23.75,28.82
FLASHSCK  (via drill 0.25)
  Top 0.254: IC3.2 18.58,30.67 v19.79,29.46 | v25.15,29.46 26.99,29.46 U3.6
  Bottom 0.254: v19.79,29.46 v25.15,29.46
GND  (via drill 0.25)
  Top 0.254: C15.2 19.07,42.74 19.07,41.17 18.58,40.68 IC3.35 18.58,38.27 18.83,38.02 18.83,37.85 v19.05,37.85 | SW2.2 14.14,38.13 14.92,37.35 15.22,37.35 15.64,36.94 15.64,36.69 16.26,36.06 IC3.42 v19.05,36.07 | IC3.18 v22.61,35.56 | IC3.5 20.08,33.78 v20.57,33.78 | IC3.THERMAL v22.86,33.78
  other vias: 42.67,41.4 38.86,43.69 30.48,29.21 14.99,26.67 7.87,27.94 14.48,39.37 20.83,35.56 22.35,37.59 19.05,34.29 20.83,37.59 14.48,43.69 4.83,28.19 12.45,37.59 29.72,30.48 29.97,35.31 26.64,36.42 12.09,40.41 10.41,50.04
  pour Bottom: 44.45,86.11 44.45,25.91 4.06,25.91 4.06,86.11
  pour Top: 2.79,92.71 2.79,24.38 45.72,24.38 45.72,92.71
LED  (via drill 0.3)
  Top 0.254: IC3.24 25.61,38.56 v27.94,40.89 | v27.94,61.21 27.94,83.31 32,87.38 R11.1
  Bottom 0.254: v27.94,40.89 v27.94,61.21
N$1
  Top 0.254: R11.2 30,89.63 LED.A
N$2
  Top 0.254: R6.1 16.54,89.47 CHG.C
N$3
  Top 0.254: C11.2 11.13,45.07 IC2.1
N$4
  Top 0.254: C11.1 11.13,47.9 IC2.8
PROG
  Top 0.254: U1.5 31.85,41.18 R8.1
PUMP_EN  (via drill 0.25)
  Top 0.254: v13.97,46.48 13.96,46.49 IC2.5 | IC3.38 16.8,38.06 16.33,38.53 16.33,43.36 v15.75,43.94
  Bottom 0.254: v15.75,43.94 13.97,45.72 v13.97,46.48
SCL  (via drill 0.25)
  Top 0.254: JP1.8 40.68,37.29 v40.64,37.33 40.64,45.15 42.71,47.22 J4.4 | v38.86,37.03 38.83,37.06 34.11,37.06 | 34.11,37.06 IC3.21 | R4.1 34.15,37.03 34.11,37.06
  Bottom 0.254: v40.64,37.33 40.34,37.03 v38.86,37.03
SCLK  (via drill 0.25)
  Top 0.254: IC3.26 23.08,40.1 23.14,40.16 23.14,41.13 22.84,41.43 22.84,41.98 v23.9,43.05 | IC1.P$1 13.24,58.13 v13.46,57.91
  Bottom 0.254: v13.46,57.91 14.05,57.33 14.05,55.45 23.9,45.59 v23.9,43.05
SCS  (via drill 0.25)
  Top 0.254: IC1.P$3 12.47,57.13 v12.93,56.66 v12.94,56.66 | IC3.28 22.08,40.37 v22.1,40.39
  Bottom 0.254: v12.94,56.66 12.94,54.71 22.1,45.55 v22.1,40.39
SDA
  Top 0.254: IC3.22 39.4,37.56 40.67,36.29 | 40.67,36.29 JP1.7 43.91,36.29 44.7,37.08 44.7,45.17 43.65,46.22 J4.3 | 40.67,36.29 39.74,35.36 R12.1
SI  (via drill 0.25)
  Top 0.254: IC3.25 23.58,41.45 v23.37,41.66 | v12.95,57.4 12.73,57.63 IC1.P$2
  Bottom 0.254: v23.37,41.66 23.37,45.11 13.54,54.94 13.54,56.82 v12.95,57.4
STAT  (via drill 0.3)
  Top 0.254: U1.1 34.1,39.91 34.66,40.46 34.66,61.86 v30.99,65.53 | v13.97,85.09 13.97,89.09 R6.2
  Bottom 0.254: v30.99,65.53 13.97,82.55 v13.97,85.09
STEMMA  (via drill 0.25, 0.3)
  Top 0.254: D6.C R16.2 11.38,38.35 13.41,40.39 v15.24,40.39 | v21.02,40.44 21.08,40.38 IC3.30
  Bottom 0.254: v21.02,40.44 15.29,40.44 v15.24,40.39
STEMMA_
  Top 0.254: STEMMA.3 9.36,40.39 R16.1
SWCLK  (via drill 0.25)
  Top 0.254: IC3.45 17.31,34.52 16.21,34.52 11.71,30.02 v11.6,30.02 | v6.6,24.89 3.3,21.59 TP6.P$1
  Bottom 0.254: v11.6,30.02 6.6,25.02 v6.6,24.89
SWDIO
  Top 0.254: IC3.46 17.31,34.02 16.36,34.02 11.82,29.49 9.18,29.49 8.9,29.21 TP7.P$1
USB_N
  Top 0.254: J2.2 24.78,52.07 19.85,47.14 19.85,45.86 19.95,45.75 19.95,40.37 19.58,40 IC3.33
USB_P
  Top 0.254: J2.3 24.13,52.07 19.39,47.33 19.39,45.49 19.5,45.39 19.5,40.85 19.08,40.43 IC3.34
V+  (via drill 0.3)  (1 unrouted)
  Top 0.305: C4.1 19.12,69.69 Q1.2 19.12,68.14 v10.92,59.94 | C4.1 16.41,72.4 U2.1 | D1.C 18.29,74.19 C4.1 | IC2.2 12.96,44.01 v12.92,43.97 C7.1
  Bottom 0.305: v10.92,59.94 7.11,56.13 7.11,49.78 v12.92,43.97
VBAT  (via drill 0.3)
  Top 0.305: X1.2 25.13,44.97 v26.16,43.94 32.51,43.94 v33.78,42.67 | v20.07,65.02 Q1.3 | v36.07,39.88 36,39.81 U1.3 36.1,38.67 C8.1
  Bottom 0.305: v26.16,43.94 20.07,50.04 v20.07,65.02 | v33.78,42.67 36.07,40.39 v36.07,39.88
VBUS  (via drill 0.3)
  Top 0.305: J2.1 25.43,85.43 v25.34,85.34 | CHG.A 18.54,85.92 D1.A 18.61,85.34 v20.32,85.34 21.02,84.65 Q1.1 v22.1,68.5 R5.1 | v35.81,43.94 36,43.75 U1.4
  Bottom 0.305: v25.34,85.34 v20.32,85.34 | v22.1,68.5 35.81,54.78 v35.81,43.94
VDDCORE
  Top 0.254: C13.1 15.58,35.56 IC3.43
X0
  Top 0.254: U$21.X0Y3 U$21.X0Y2 U$21.X0Y1 U$21.X0Y0 40.15,25.13 33.95,31.32 24.09,31.32 23.58,31.83 IC3.12
X1
  Top 0.254: U$21.X1Y3 U$21.X1Y2 U$21.X1Y1 U$21.X1Y0 33.7,22.68 32.89,23.49 28.32,23.49 23.08,28.74 IC3.11
X2
  Top 0.254: U$21.X2Y3 U$21.X2Y2 U$21.X2Y1 U$21.X2Y0 27.26,23.03 22.58,27.71 IC3.10
X3
  Top 0.254: U$21.X3Y3 U$21.X3Y2 U$21.X3Y1 U$21.X3Y0 22.08,22.58 IC3.9
X4
  Top 0.254: U$21.X4Y3 U$21.X4Y2 U$21.X4Y1 U$21.X4Y0 17.05,24.13 18.54,24.13 21.58,27.17 IC3.8
X5
  Top 0.254: U$21.X5Y3 U$21.X5Y2 U$21.X5Y1 U$21.X5Y0 8.05,22.02 11.94,25.91 19.34,25.91 21.08,27.65 IC3.7
Y0  (via drill 0.25)
  Top 0.254: IC3.4 19.58,31.58 20.32,30.84 20.32,28.12 v20.4,28.04 | U$21.Y0X4 17.78,20.7 17.78,22.35 v21.55,26.12
  Bottom 0.254: U$21.Y0X6 U$21.Y0X5 U$21.Y0X4 U$21.Y0X3 U$21.Y0X2 U$21.Y0X1 U$21.Y0X0 | v21.55,26.12 21.55,26.89 v20.4,28.04
Y1
  Top 0.254: IC3.48 17.06,33.06 4.32,20.32 4.32,14.7 U$21.Y1X6
  Bottom 0.305: U$21.Y1X6 U$21.Y1X5 U$21.Y1X4 U$21.Y1X3 U$21.Y1X2 U$21.Y1X1 U$21.Y1X0
Y2
  Top 0.254: U$21.Y2X6 3.56,9.15 3.56,20.57 16.55,33.56 IC3.47
  Bottom 0.305: U$21.Y2X0 U$21.Y2X1 U$21.Y2X2 U$21.Y2X3 U$21.Y2X4 U$21.Y2X5 U$21.Y2X6

### Text on the board
tPlace: Based on Adafruit's / 2.7" Sharp Memory / Display breakout. / CS is active high! | WHAT | IS | THIS THING? | SWDIO | GND | 3V3 | SWCLK | RESET | OSO-MISC-20-018 / CC-BY-SA 4.0, whatever it is